# EAGLE design esp32-ind-controller-r1 (EAGLE 9.6.2)
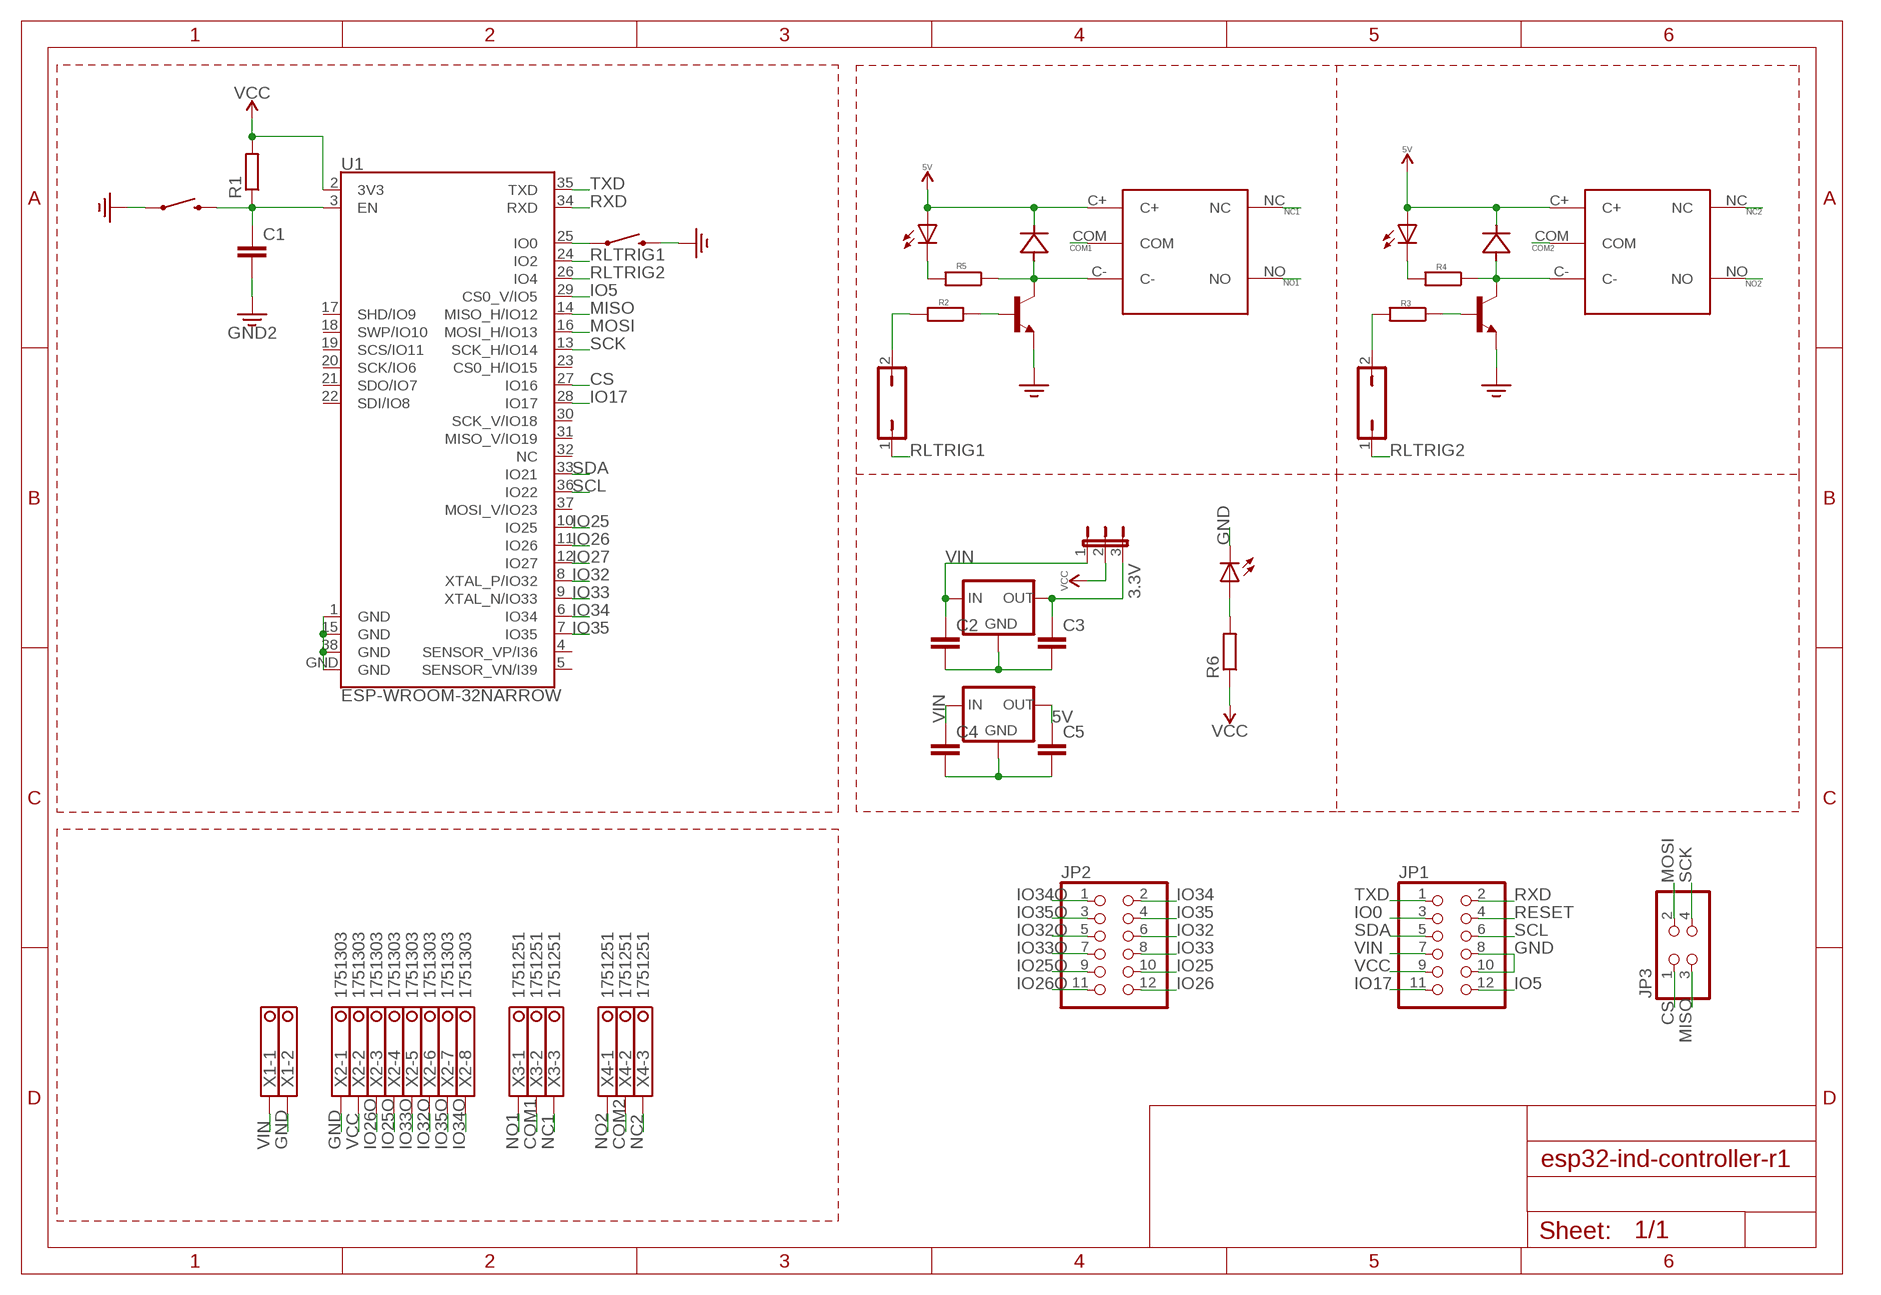
[diagram p0: schematic, sheet 1]

## Parts
C1  C1206  [C1206]
C2  C1206  [C1206]
C3  C1206  [C1206]
C4  C1206  [C1206]
C5  C1206  [C1206]
JP1  PINHD-2X6  [2X06]
JP2  PINHD-2X6  [2X06]
JP3  PINHD-2X2  [2X02]
R1  R1206  [R1206]
R2  R1206  [R1206]
R3  R1206  [R1206]
R4  R1206  [R1206]
R5  R1206  [R1206]
R6  R1206  [R1206]
U1  ESP-WROOM-32NARROW  [ESP-WROOM-32-NARROW]
U$1  RELAY-SONGLE-05V  [RELAY-SONGLE-05V]
U$2  RELAY-SONGLE-05V  [RELAY-SONGLE-05V]
U$3  TACT-SW-SMD  [TACTILE_SWITCH_SMD_6.0X3.5MM]
U$4  TACT-SW-SMD  [TACTILE_SWITCH_SMD_6.0X3.5MM]
U$5  MBR0520_DIODE  [SOD123]
U$6  MMBT3904_NPN_TRAN  [SOT23]
U$7  MMBT3904_NPN_TRAN  [SOT23]
U$8  MBR0520_DIODE  [SOD123]
U$9  CHIPLED_1206GREEN  [CHIPLED_1206_GRN]
U$10  CHIPLED_1206GREEN  [CHIPLED_1206_GRN]
U$11  JP-2  [JP2]
U$12  LD1117-SOT223  [SOT223]
U$13  CHIPLED_1206GREEN  [CHIPLED_1206_GRN]
U$14  LD1117-SOT223  [SOT223]
U$15  JP-1  [JP1]
U$16  JP-1  [JP1]
X1  1751248  [1751248]
X2  1751303  [1751303]
X3  1751251  [1751251]
X4  1751251  [1751251]

## Nets
3.3V: C3.1 U$11.3 U$12.2(OUT) U$12.4(OUT)
5V: C5.1 U$1.C+ U$2.C+ U$5.C U$8.C U$9.A U$10.A U$14.2(OUT) U$14.4(OUT)
COM1: U$1.COM X3.2
COM2: U$2.COM X4.2
CS: JP3.1 U1.27(IO16)
GND: C1.2 C2.2 C3.2 C4.2 C5.2 JP1.8 JP1.10 U1.1(GND) U1.15(GND) U1.38(GND) U1.GND U$3.1 U$4.2 U$6.2(E) U$7.2(E) U$12.1(GND) U$13.C U$14.1(GND) X1.2 X2.1 ; supply symbol labelled GND2
IO0: JP1.3 U1.25(IO0) U$4.1
IO5: JP1.12 U1.29(CS0_V/IO5)
IO17: JP1.11 U1.28(IO17)
IO25: JP2.10 U1.10(IO25)
IO25O: JP2.9 X2.4
IO26: JP2.12 U1.11(IO26)
IO26O: JP2.11 X2.3
IO27: U1.12(IO27)
IO32: JP2.6 U1.8(XTAL_P/IO32)
IO32O: JP2.5 X2.6
IO33: JP2.8 U1.9(XTAL_N/IO33)
IO33O: JP2.7 X2.5
IO34: JP2.2 U1.6(IO34)
IO34O: JP2.1 X2.8
IO35: JP2.4 U1.7(IO35)
IO35O: JP2.3 X2.7
MISO: JP3.3 U1.14(MISO_H/IO12)
MOSI: JP3.2 U1.16(MOSI_H/IO13)
N$1: R6.2 U$13.A
N$2: R5.1 U$1.C- U$5.A U$6.3(C)
N$3: R5.2 U$10.C
N$4: R4.1 U$2.C- U$7.3(C) U$8.A
N$5: R2.1 U$6.1(B)
N$6: R2.2 U$16.2
N$7: R3.1 U$7.1(B)
N$8: R3.2 U$15.2
N$9: R4.2 U$9.C
NC1: U$1.NC X3.3
NC2: U$2.NC X4.3
NO1: U$1.NO X3.1
NO2: U$2.NO X4.1
RESET: C1.1 JP1.4 R1.1 U1.3(EN) U$3.2
RLTRIG1: U1.24(IO2) U$16.1
RLTRIG2: U1.26(IO4) U$15.1
RXD: JP1.2 U1.34(RXD)
SCK: JP3.4 U1.13(SCK_H/IO14)
SCL: JP1.6 U1.36(IO22)
SDA: JP1.5 U1.33(IO21)
TXD: JP1.1 U1.35(TXD)
VCC: JP1.9 R1.2 R6.1 U1.2(3V3) U$11.2 X2.2
VIN: C2.1 C4.1 JP1.7 U$11.1 U$12.3(IN) U$14.3(IN) X1.1
Unconnected: U1.4(SENSOR_VP/I36) U1.5(SENSOR_VN/I39) U1.17(SHD/IO9) U1.18(SWP/IO10) U1.19(SCS/IO11) U1.20(SCK/IO6) U1.21(SDO/IO7) U1.22(SDI/IO8) U1.23(CS0_H/IO15) U1.30(SCK_V/IO18) U1.31(MISO_V/IO19) U1.32(NC) U1.37(MOSI_V/IO23)

## Library data of the parts
C1-C5 = baymonitoring:C1206
JP1 JP2 = pinhead:PINHD-2X6: PIN HEADER
JP3 = pinhead:PINHD-2X2: PIN HEADER
R1-R6 = baymonitoring:R1206
U1 = baymonitoring:ESP-WROOM-32; PROD_ID: IC-13849
U$1 U$2 = baymonitoring:RELAY-SONGLE-05V
U$3 U$4 = baymonitoring:TACT-SW-SMD
U$5 U$8 = baymonitoring:MBR0520_DIODE
U$6 U$7 = baymonitoring:MMBT3904_NPN_TRAN
U$9 U$10 U$13 = baymonitoring:CHIPLED_1206
U$11 = baymonitoring:JP-2
U$12 U$14 = baymonitoring:LD1117-SOT223
U$15 U$16 = baymonitoring:JP-1
X1 = con-phoenix-350:1751248: MKDS 1/ 2-3,5 Printklemme Nennstrom: 10 A Bemessungsspannung: 160 V Raster: 3,5 mm Polzahl: 2 Montageart: Löten Anschlussart: Schraubanschluss Anschlussrichtung vom Leiter zur Platine: 0° Source: http://eshop.phoenixcontact.com .. 1751248.pdf; OC_FARNELL: unknown; OC_NEWARK: unknown
X2 = con-phoenix-350:1751303: MKDS 1/ 8-3,5 Printklemme Nennstrom: 10 A Bemessungsspannung: 160 V Raster: 3,5 mm Polzahl: 8 Montageart: Löten Anschlussart: Schraubanschluss Anschlussrichtung vom Leiter zur Platine: 0° Source: http://eshop.phoenixcontact.com .. .pdf; OC_FARNELL: unknown; OC_NEWARK: unknown
X3 X4 = con-phoenix-350:1751251: MKDS 1/ 3-3,5 Printklemme Nennstrom: 10 A Bemessungsspannung: 160 V Raster: 3,5 mm Polzahl: 3 Montageart: Löten Anschlussart: Schraubanschluss Anschlussrichtung vom Leiter zur Platine: 0° Source: http://eshop.phoenixcontact.com .. 1751251.pdf; OC_FARNELL: unknown; OC_NEWARK: unknown

## Board
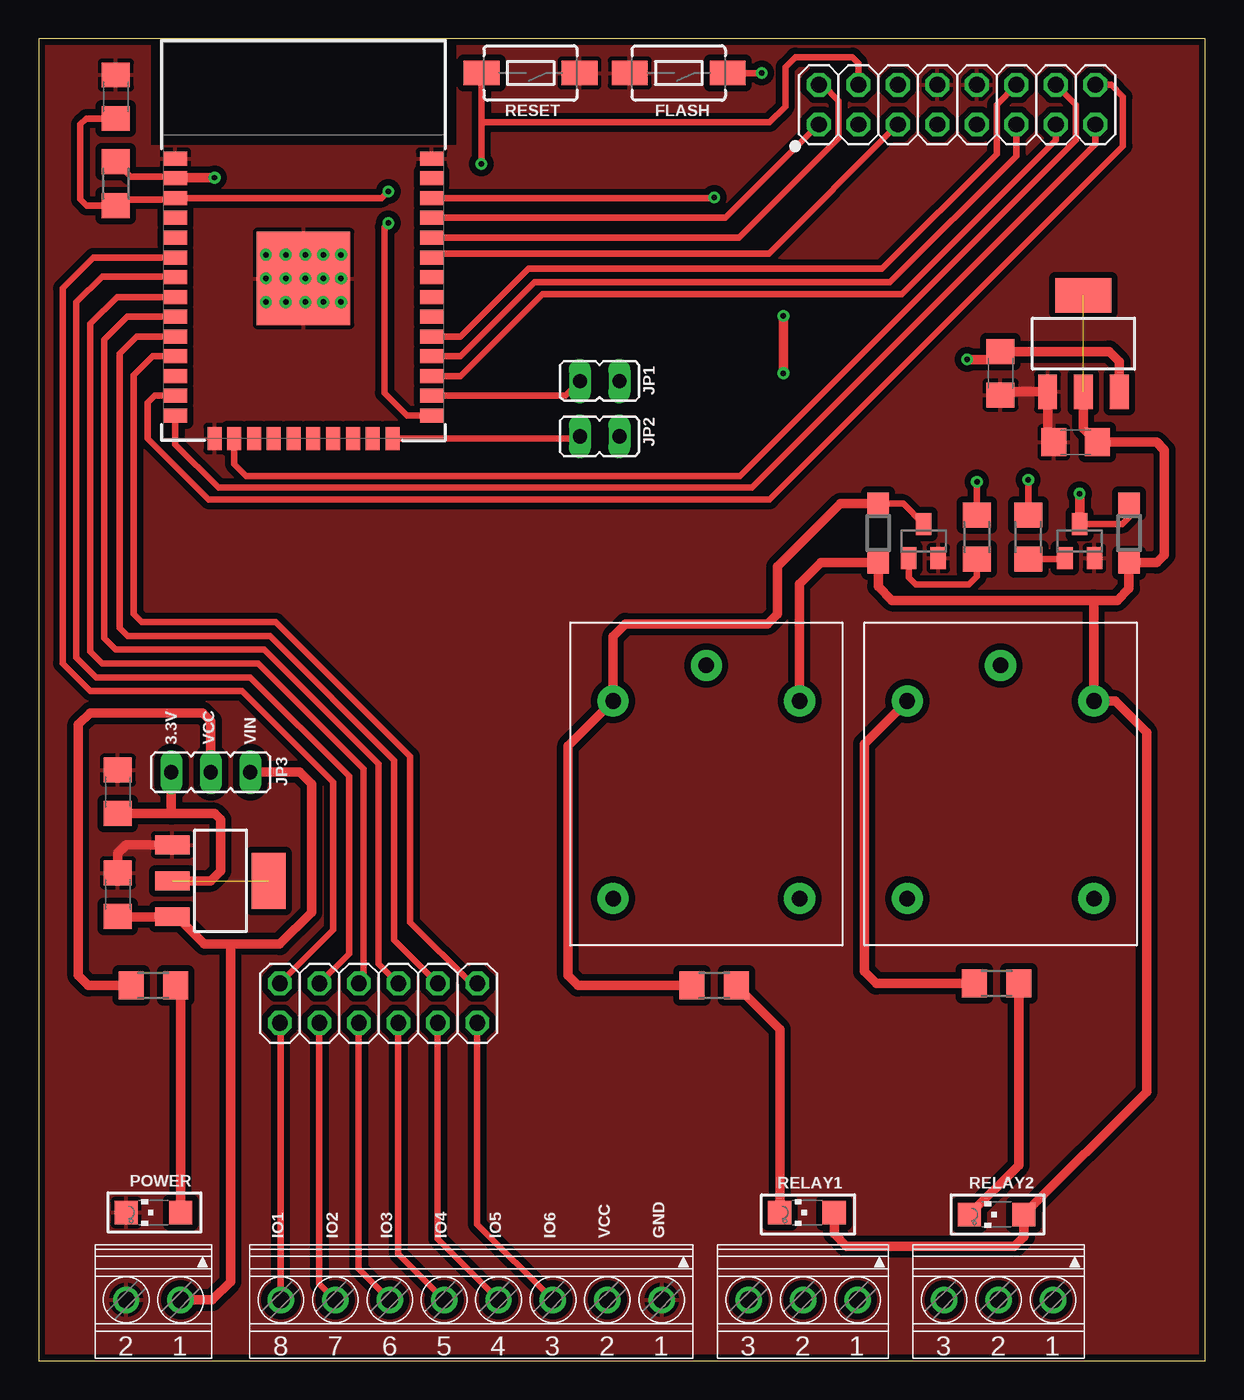
[diagram p1: board, top side]
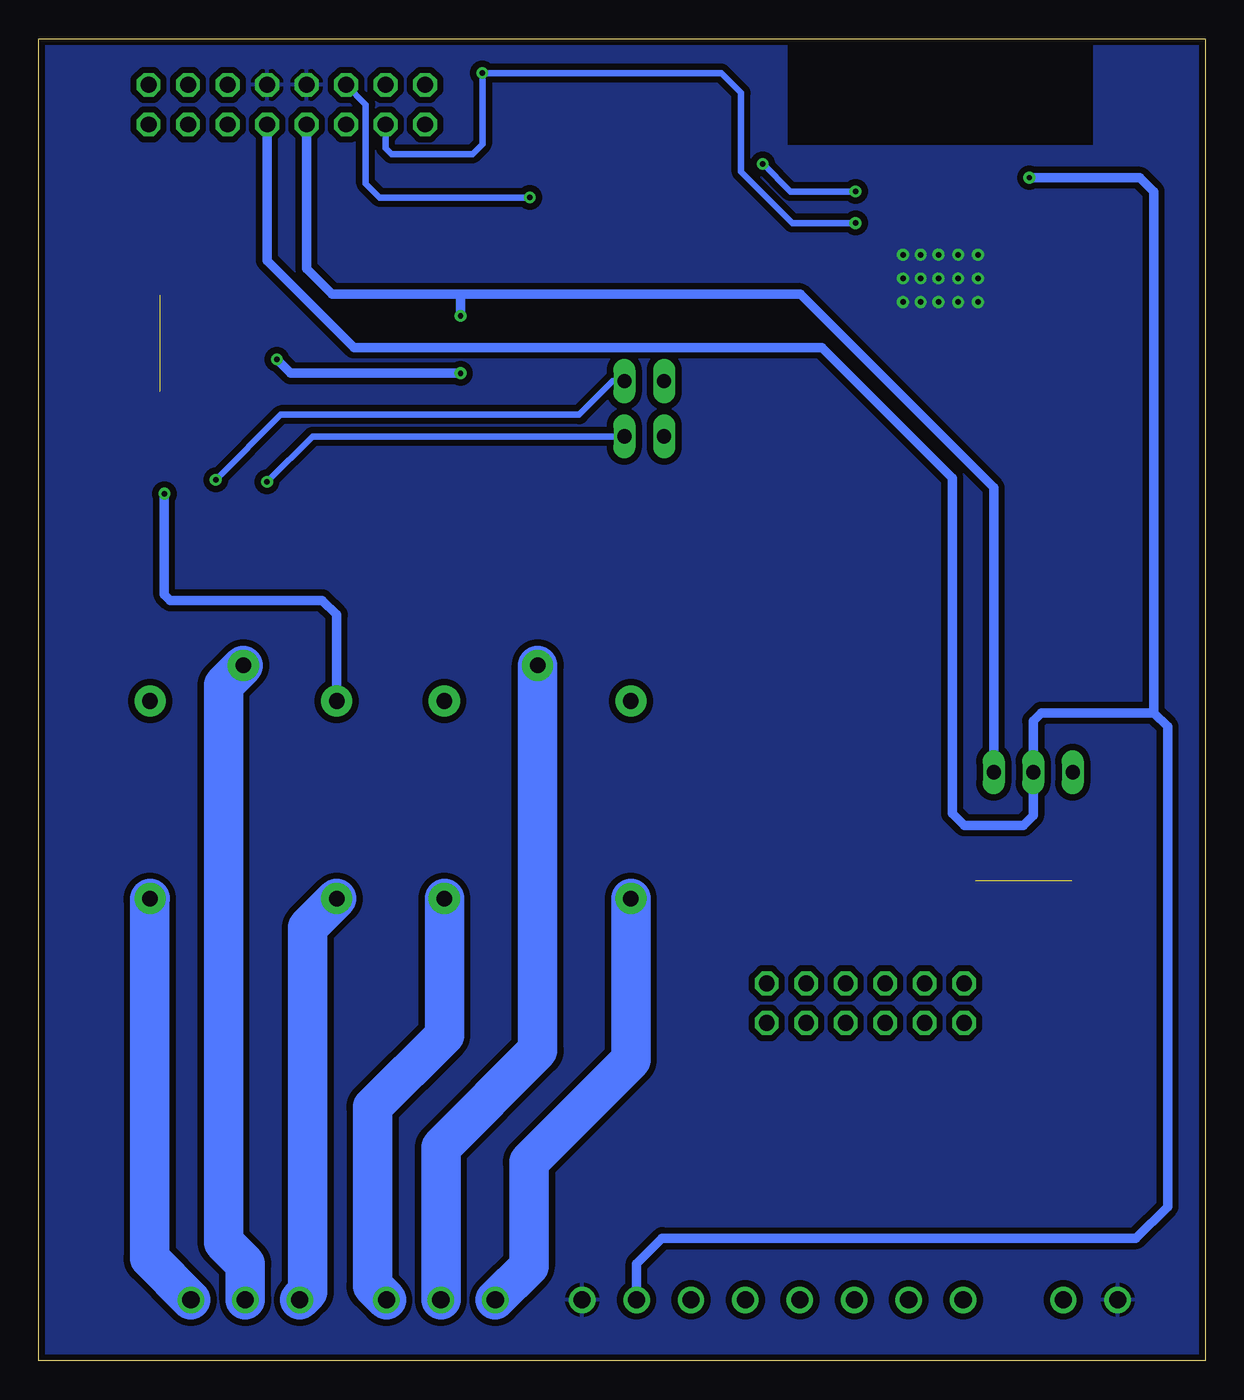
[diagram p2: board, bottom side, seen from below]

Size 75 x 85 mm. Coordinates in mm from the lower left corner, seen from the top.
Outline: 0,0 75,0 75,85 0,85 0,0
Copper layers (1*16): Top 0.035mm / dielectric 1.5mm / Bottom 0.035mm
Design rules "default *": minimum track width 6mil, minimum drill 0.35mm, track to track 6mil, track to pad 6mil, pad to pad 6mil, via to via 6mil, smd to smd 6mil, copper to edge 12mil, drill to drill 6mil, minimum pad ring 10mil, minimum via ring 8mil, stop-mask expansion 4mil, vias tented up to drill 0mil, thermal gap 10mil

### Footprints (pad centres in the part's own frame; a part is rotated, then mirrored left to right if it is on the bottom)
C1206 = smd 1.6 x 1.8: 1 -1.4,0; 2 1.4,0
2X06 = drill 1.016 octagon: 1 -6.35,-1.27; 2 -6.35,1.27; 3 -3.81,-1.27; 4 -3.81,1.27; 5 -1.27,-1.27; 6 -1.27,1.27; 7 1.27,-1.27; 8 1.27,1.27; 9 3.81,-1.27; 10 3.81,1.27; 11 6.35,-1.27; 12 6.35,1.27
2X02 = drill 1.016 octagon: 1 -1.27,-1.27; 2 -1.27,1.27; 3 1.27,-1.27; 4 1.27,1.27
R1206 = smd 1.6 x 1.803: 1 -1.422,0; 2 1.422,0
ESP-WROOM-32-NARROW = smd 0.9 x 1.5: 1 6.43,8.238; 2 5.16,8.238; 3 3.89,8.238; 4 2.62,8.238; 5 1.35,8.238; 6 0.08,8.238; 7 -1.19,8.238; 8 -2.46,8.238; 9 -3.73,8.238; 10 -5,8.238; 11 -6.27,8.238; 12 -7.54,8.238; 13 -8.81,8.238; 14 -10.08,8.238; 25 -10.08,-8.238; 26 -8.81,-8.238; 27 -7.54,-8.238; 28 -6.27,-8.238; 29 -5,-8.238; 30 -3.73,-8.238; 31 -2.46,-8.238; 32 -1.19,-8.238; 33 0.08,-8.238; 34 1.35,-8.238; 35 2.62,-8.238; 36 3.89,-8.238; 37 5.16,-8.238; 38 6.43,-8.238 | smd 1.5 x 0.9: 15 -11.57,5.715; 16 -11.57,4.445; 17 -11.57,3.175; 18 -11.57,1.905; 19 -11.57,0.635; 20 -11.57,-0.635; 21 -11.57,-1.905; 22 -11.57,-3.175; 23 -11.57,-4.445; 24 -11.57,-5.715 | smd 6 x 6: GND -1.27,0
RELAY-SONGLE-05V = drill 1 pad 2: C+ -5.999,-3.683; C- 6.001,-3.683; COM 0.001,-5.969; NC 6.001,9.017; NO -5.999,9.017
TACTILE_SWITCH_SMD_6.0X3.5MM = smd 2.3 x 1.6: 1 -3.15,0; 2 3.15,0
SOD123 = smd 1.4 x 1.4: A 1.9,0; C -1.9,0
SOT23 = smd 1 x 1.4: 1 -0.95,-1.1; 2 0.95,-1.1; 3 0,1.1
CHIPLED_1206_GRN = smd 1.5 x 1.5: A 0,-1.75; C 0,1.75
JP2 = drill 0.914 long: 1 -2.54,0; 2 0,0; 3 2.54,0
SOT223 = smd 1.219 x 2.235: 1 -2.311,-3.099; 2 0,-3.099; 3 2.311,-3.099 | smd 3.6 x 2.2: 4 0,3.099
JP1 = drill 0.914 long: 1 0,-1.27; 2 0,1.27
1751248 = drill 1.1 pad 1.7: 1 -1.75,-0.1; 2 1.75,-0.1
1751303 = drill 1.1 pad 1.7: 1 -12.25,-0.1; 2 -8.75,-0.1; 3 -5.25,-0.1; 4 -1.75,-0.1; 5 1.75,-0.1; 6 5.25,-0.1; 7 8.75,-0.1; 8 12.25,-0.1
1751251 = drill 1.1 pad 1.7: 1 -3.5,-0.1; 2 0,-0.1; 3 3.5,-0.1

### Placement (x,y rotation side)
C1  4.95,81.28 90 top
C2  5.08,29.97 90 top
C3  5.08,36.58 90 top
C4  61.85,63.5 270 top
C5  66.67,59.05 180 top
JP1  56.52,80.77 0 top
JP2  21.84,22.99 0 top
JP3  66.67,80.77 0 top
R1  4.95,75.69 90 top
R2  60.33,52.96 90 top
R3  63.63,52.96 90 top
R4  61.59,24.26 0 top
R5  43.43,24.13 0 top
R6  7.37,24.13 0 top
U1  17.02,70.87 90 top
U$1  42.93,38.73 180 top
U$2  61.85,38.73 180 top
U$3  31.62,82.8 180 top
U$4  41.15,82.8 180 top
U$5  53.98,53.21 90 top
U$6  56.9,52.7 0 top
U$7  66.93,52.7 0 top
U$8  70.1,53.21 90 top
U$9  61.59,9.4 90 top
U$10  49.4,9.53 90 top
U$11  11.05,37.85 180 top
U$12  11.68,30.86 270 top
U$13  7.37,9.53 90 top
U$14  67.18,65.41 0 top
U$15  36.07,62.99 270 top
U$16  36.07,59.44 270 top
X1  7.37,3.81 180 top
X2  27.81,3.81 180 top
X3  49.15,3.81 180 top
X4  61.72,3.81 180 top

### Tracks (layer width: path | path; a pad name or v marks a point on that pad's centre or on a via)
3.3V  (1 unrouted)
  Top 0.61: U$12.2 11.05,30.86 11.68,31.5 11.68,34.8 11.3,35.18 8.51,35.18 | 8.51,35.18 C3.1 | U$11.3 8.51,35.18
5V  (1 unrouted)
  Top 0.61: U$10.A 51.15,8.16 51.94,7.37 62.74,7.37 63.34,7.97 U$9.A 71.25,17.3 71.25,40.39 69.22,42.42 U$2.C+ 67.85,48.87 67.82,48.9 | U$14.2 67.18,59.95 C5.1 71.88,59.05 72.39,58.55 72.39,51.82 71.89,51.31 U$8.C 70.1,49.66 69.34,48.9 67.82,48.9 | 67.82,48.9 54.86,48.9 53.98,49.78 U$5.C 50.3,51.31 48.92,49.94 U$1.C+
COM1
  Bottom 2.54: X3.2 49.15,13.72 42.92,19.94 U$1.COM
COM2
  Bottom 2.54: X4.2 61.72,6.22 63.12,7.62 63.12,43.43 U$2.COM
CS
  Top 0.406: U1.27 27.13,63.33 32.38,68.58 55.5,68.58 65.41,78.49 JP3.1
GND  (via drill 0.35)
  Top 0.61: U$12.1 5.61,33.17 5.08,32.64 C2.2 | C5.2 64.87,59.46 U$14.1 62.05,62.31 C4.2
  other vias: 17.14,69.6 15.88,69.6 14.61,69.6 18.29,69.6 19.43,69.6 17.14,71.12 15.88,71.12 14.61,71.12 18.29,71.12 19.43,71.12 17.14,68.07 15.88,68.07 14.61,68.07 18.29,68.07 19.43,68.07
  pour Top (isolate 0.406): 0,84.96 7.11,84.96 7.11,78.11 26.92,78.11 26.92,84.96 74.93,84.96 74.93,0 0,0
  pour Bottom (isolate 0.406): 0,84.96 7.11,84.96 7.11,78.11 26.92,78.11 26.92,84.96 74.93,84.96 74.93,0 0,0
IO0  (via drill 0.35)
  Top 0.406: v46.48,82.8 U$4.1 | U1.25 23.67,60.79 22.23,62.23 22.23,72.9 v22.48,73.15
  Bottom 0.406: JP1.3 52.7,77.98 52.32,77.6 47.12,77.6 46.48,78.23 v46.48,82.8 31.11,82.8 29.84,81.53 29.84,76.45 26.54,73.15 v22.48,73.15
IO5
  Top 0.406: U1.29 27.13,65.87 31.5,70.23 47.62,70.23 54.23,70.23 61.59,77.6 61.59,80.77 JP1.12
IO17
  Top 0.406: U1.28 27.13,64.6 31.88,69.34 54.74,69.34 62.87,77.47 JP1.11
IO25
  Top 0.406: U1.10 6.3,65.87 5.21,64.77 5.21,47.12 5.71,46.61 14.86,46.61 22.86,38.61 22.86,27.05 JP2.10
IO25O
  Top 0.406: JP2.9 25.65,7.82 X2.4
IO26
  Top 0.406: U1.11 7.32,64.6 6.1,63.37 6.1,48.01 6.6,47.5 15.24,47.5 23.88,38.86 23.88,28.19 27.81,24.26 JP2.12
IO26O
  Top 0.406: JP2.11 28.19,8.78 X2.3
IO32
  Top 0.406: U1.8 5.03,68.41 3.3,66.67 3.3,45.59 4.06,44.83 14.1,44.83 20.89,38.04 20.89,24.57 JP2.6
IO32O
  Top 0.406: JP2.5 20.57,5.9 X2.6
IO33
  Top 0.406: U1.9 5.67,67.14 4.19,65.66 4.19,46.48 4.95,45.72 14.48,45.72 21.84,38.35 21.84,25.53 JP2.8
IO33O
  Top 0.406: JP2.7 23.11,6.86 X2.5
IO34
  Top 0.406: U1.6 3.51,70.95 1.52,68.96 1.52,44.83 3.3,43.05 13.08,43.05 18.92,37.21 18.92,27.69 JP2.2
IO34O
  Top 0.406: X2.8 15.56,21.65 JP2.1
IO35
  Top 0.406: U1.7 8.73,69.72 4.06,69.72 2.41,68.07 2.41,45.21 3.68,43.94 13.59,43.94 19.94,37.59 19.94,26.16 JP2.4
IO35O
  Top 0.406: JP2.3 18.03,4.94 X2.7
MISO
  Top 0.406: U1.14 8.78,58.91 11.56,56.13 45.85,56.13 67.94,78.23 JP3.3
MOSI
  Top 0.406: U1.16 12.57,57.66 13.34,56.9 45.09,56.9 66.67,78.49 66.67,80.77 JP3.2
N$1
  Top 0.61: 8.79,9.85 U$13.A 9.12,23.8 R6.2
N$2
  Top 0.406: U$6.3 55.59,55.11 U$5.A
  Top 0.61: R5.1 34.67,24.13 34.04,24.77 34.04,39.53 U$1.C- 36.92,46.58 37.72,47.37 46.86,47.37 47.5,48.01 47.5,51.05 51.56,55.11 U$5.A
N$3
  Top 0.406: 44.86,24.11 R5.2
  Top 0.61: U$10.C 47.65,21.31 44.86,24.11
N$4  (via drill 0.35)
  Top 0.406: U$7.3 69.68,53.8 70.1,54.23 U$8.A
  Top 0.61: R4.1 53.85,24.26 53.09,25.02 53.09,39.66 U$2.C- | v66.93,55.75 U$7.3
  Bottom 0.61: U$2.C- 55.85,47.97 56.77,48.9 66.55,48.9 66.93,49.28 v66.93,55.75
N$5
  Top 0.406: U$6.1 55.95,50.35 56.39,49.91 59.82,49.91 60.33,50.42 R2.1
N$6  (via drill 0.35)
  Top 0.406: v60.33,56.52 R2.2
  Bottom 0.406: U$16.2 57.4,59.44 v60.33,56.52
N$7
  Top 0.406: U$7.1 65.91,51.54 R3.1
N$8  (via drill 0.35)
  Top 0.406: v63.63,56.64 R3.2
  Bottom 0.406: U$15.2 38.1,62.99 40.26,60.83 59.44,60.83 v63.63,56.64
N$9
  Top 0.61: U$9.C 63.02,12.57 R4.2
NC1
  Bottom 2.54: X3.3 43.49,6.07 43.49,12.77 36.92,19.34 U$1.NC
NC2
  Bottom 2.54: X4.3 57.71,4.42 57.71,27.85 U$2.NC
NO1
  Bottom 2.54: X3.1 53.54,4.8 53.54,16.31 48.92,20.93 U$1.NO
NO2
  Bottom 2.54: X4.1 67.89,6.58 67.89,29.68 U$2.NO
RESET  (via drill 0.35)
  Top 0.406: C1.1 3.04,79.88 2.67,79.5 2.67,74.68 3.07,74.27 R1.1 5.33,74.65 8.68,74.65 U1.3 22.05,74.76 v22.48,75.18 | JP1.4 52.7,83.44 52.32,83.82 48.64,83.82 48.01,83.19 48.01,80.64 46.99,79.63 28.47,79.63 U$3.2 28.47,76.99 v28.45,76.96
  Bottom 0.406: v22.48,75.18 26.67,75.18 v28.45,76.96
RLTRIG1
  Top 0.406: U1.24 34.66,59.3 U$16.1
RLTRIG2
  Top 0.406: U1.26 33.86,62.06 U$15.1
RXD
  Top 0.406: U1.34 45.04,72.22 51.44,78.61 51.44,81.03 50.42,82.04 JP1.2
SCK
  Top 0.406: U1.13 7.45,62.06 6.99,61.59 6.99,59.31 10.92,55.37 46.99,55.37 53.34,61.72 69.72,78.11 69.72,81.28 68.96,82.04 JP3.4
SCL  (via drill 0.35)
  Top 0.406: U1.36 43.39,74.76 v43.43,74.8
  Bottom 0.406: v43.43,74.8 53.09,74.8 53.98,75.69 53.98,80.77 JP1.6
SDA
  Top 0.406: U1.33 25.51,71.2 46.94,71.2 JP1.5
TXD
  Top 0.406: U1.35 44.15,73.49 JP1.1
VCC  (via drill 0.35)
  Top 0.406: R1.2 5.91,76.15 8.65,76.15 U1.2
  Top 0.61: R6.1 3.17,24.13 2.54,24.77 2.54,40.89 3.3,41.66 10.54,41.66 11.05,41.15 U$11.2 | v11.3,76.07 8.73,76.07 8.65,76.15
  Bottom 0.61: X2.2 36.56,6.24 34.92,7.87 4.45,7.87 2.41,9.91 2.41,40.77 3.3,41.66 | 3.3,41.66 10.54,41.66 11.05,41.15 U$11.2 11.05,35.05 11.68,34.42 15.49,34.42 16.26,35.18 16.26,56.77 24.64,65.15 54.74,65.15 60.33,70.74 JP1.9 | v11.3,76.07 4.19,76.07 3.3,75.18 3.3,41.66
VIN  (via drill 0.35)
  Top 0.61: 8.56,28.57 U$12.3 | U$12.3 8.91,28.55 9.12,28.35 9.12,28.32 10.64,26.8 12.32,26.8 | U$11.1 16.76,37.85 17.53,37.08 17.53,28.83 15.49,26.8 12.32,26.8 | U$12.3 5.1,28.55 C2.1 | X1.1 11.15,3.91 12.32,5.08 12.32,26.8 | U$14.3 69.49,64.24 68.83,64.9 C4.1 61.34,64.39 v59.69,64.39 | v47.88,63.5 v47.88,67.18
  Bottom 0.61: U$11.1 13.59,56.13 26.04,68.58 47.88,68.58 | JP1.7 57.78,70.23 56.13,68.58 47.88,68.58 | v59.69,64.39 58.8,63.5 v47.88,63.5 | v47.88,67.18 47.88,68.58

### Text on the board
tPlace: RESET | FLASH | JP1 | JP2 | 3.3V | VCC | VIN | JP3 | POWER | RELAY1 | RELAY2 | IO1 | IO2 | IO3 | IO4 | IO5 | IO6 | VCC | GND